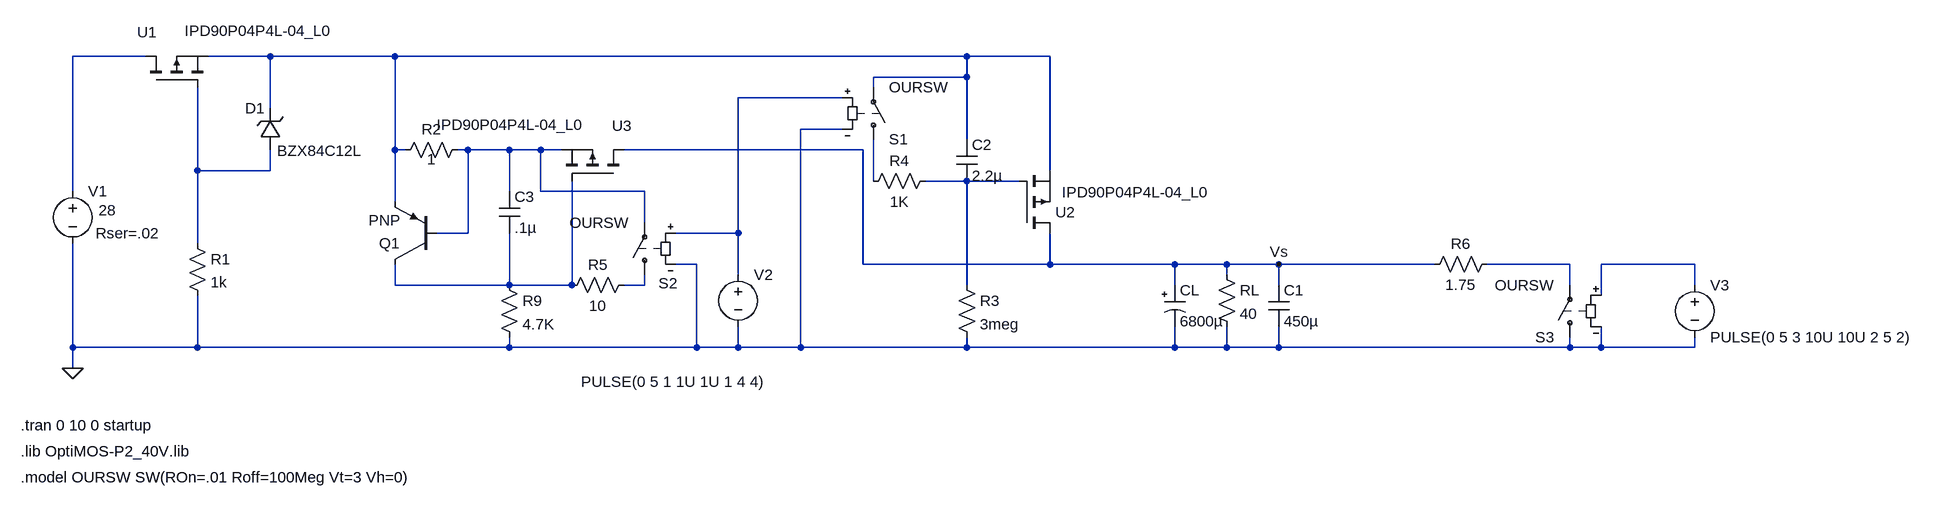
[diagram p0: schematic power_cond_2.asc]
power_cond_2.asc, the LTspice schematic file:
Version 4
SHEET 1 2268 1624
WIRE -1280 -176 -1392 -176
WIRE -1088 -176 -1184 -176
WIRE -896 -176 -1088 -176
WIRE -16 -176 -896 -176
WIRE 112 -176 -16 -176
WIRE -16 -144 -16 -176
WIRE -16 -144 -160 -144
WIRE -160 -128 -160 -144
WIRE -208 -112 -368 -112
WIRE -1088 -96 -1088 -176
WIRE -208 -64 -272 -64
WIRE -16 -48 -16 -144
WIRE -896 -32 -896 -176
WIRE -880 -32 -896 -32
WIRE -784 -32 -800 -32
WIRE -720 -32 -784 -32
WIRE -672 -32 -720 -32
WIRE -640 -32 -672 -32
WIRE -176 -32 -544 -32
WIRE -1200 0 -1200 -128
WIRE -1088 0 -1088 -32
WIRE -1088 0 -1200 0
WIRE 112 0 112 -176
WIRE -160 16 -160 -48
WIRE -16 16 -16 0
WIRE -16 16 -80 16
WIRE 64 16 -16 16
WIRE -1392 32 -1392 -176
WIRE -720 32 -720 -32
WIRE -672 32 -672 -32
WIRE -512 32 -672 32
WIRE -896 48 -896 -32
WIRE -512 80 -512 32
WIRE -784 96 -784 -32
WIRE -784 96 -832 96
WIRE -368 96 -368 -112
WIRE -368 96 -464 96
WIRE -1200 112 -1200 0
WIRE -432 144 -464 144
WIRE -176 144 -176 -32
WIRE 112 144 112 96
WIRE 112 144 -176 144
WIRE 304 144 112 144
WIRE 384 144 304 144
WIRE 464 144 384 144
WIRE 704 144 464 144
WIRE 912 144 784 144
WIRE 1104 144 960 144
WIRE -368 160 -368 96
WIRE 384 160 384 144
WIRE -896 176 -896 144
WIRE -720 176 -720 96
WIRE -720 176 -896 176
WIRE -624 176 -624 16
WIRE -624 176 -720 176
WIRE -512 176 -512 160
WIRE -512 176 -544 176
WIRE -16 176 -16 16
WIRE 304 176 304 144
WIRE 464 176 464 144
WIRE 912 176 912 144
WIRE 1104 176 1104 144
WIRE 960 192 960 144
WIRE -1392 272 -1392 112
WIRE -1200 272 -1200 192
WIRE -1200 272 -1392 272
WIRE -720 272 -720 256
WIRE -720 272 -1200 272
WIRE -432 272 -432 144
WIRE -432 272 -720 272
WIRE -368 272 -368 240
WIRE -368 272 -432 272
WIRE -272 272 -272 -64
WIRE -272 272 -368 272
WIRE -16 272 -16 256
WIRE -16 272 -272 272
WIRE 304 272 304 240
WIRE 304 272 -16 272
WIRE 384 272 384 240
WIRE 384 272 304 272
WIRE 464 272 464 240
WIRE 464 272 384 272
WIRE 912 272 912 256
WIRE 912 272 464 272
WIRE 960 272 960 240
WIRE 960 272 912 272
WIRE 1104 272 1104 256
WIRE 1104 272 960 272
WIRE -1392 304 -1392 272
FLAG -1392 304 0
FLAG 464 144 Vs
SYMBOL voltage -1392 16 R0
WINDOW 3 40 45 Left 2
WINDOW 123 0 0 Left 2
WINDOW 39 35 80 Left 2
SYMATTR Value 28
SYMATTR SpiceLine Rser=.02
SYMATTR InstName V1
SYMBOL res -1216 96 R0
SYMATTR InstName R1
SYMATTR Value 1k
SYMATTR SpiceLine tol=1 pwr=.125
SYMBOL polcap 288 176 R0
WINDOW 3 24 56 Left 2
SYMATTR Value 6800µ
SYMATTR InstName CL
SYMATTR SpiceLine V=35 Irms=3.67 Rser=0.03 Lser=0
SYMATTR Description Capacitor
SYMATTR Type cap
SYMBOL res 368 144 R0
SYMATTR InstName RL
SYMATTR Value 40
SYMBOL zener -1072 -32 R180
WINDOW 0 24 64 Left 2
WINDOW 3 -126 -1 Left 2
SYMATTR InstName D1
SYMATTR Value BZX84C12L
SYMBOL pmos -1280 -128 R270
WINDOW 0 85 -13 VRight 2
WINDOW 3 87 60 VRight 2
SYMATTR InstName U1
SYMATTR Value IPD90P04P4L-04_L0
SYMATTR Prefix X
SYMBOL cap 448 176 R0
SYMATTR InstName C1
SYMATTR Value 450µ
SYMBOL pmos 64 96 M180
WINDOW 3 66 63 Left 2
SYMATTR Value IPD90P04P4L-04_L0
SYMATTR InstName U2
SYMATTR Prefix X
SYMBOL res -784 -48 R90
WINDOW 0 0 56 VBottom 2
WINDOW 3 15 56 VTop 2
SYMATTR InstName R2
SYMATTR Value 1
SYMBOL pnp -832 144 R180
SYMATTR InstName Q1
SYMBOL cap -736 32 R0
SYMATTR InstName C3
SYMATTR Value .1µ
SYMBOL res -736 160 R0
SYMATTR InstName R9
SYMATTR Value 4.7K
SYMBOL pmos -544 16 M270
WINDOW 0 85 -13 VRight 2
WINDOW 3 87 60 VRight 2
SYMATTR InstName U3
SYMATTR Value IPD90P04P4L-04_L0
SYMATTR Prefix X
SYMBOL cap -32 -48 R0
SYMATTR InstName C2
SYMATTR Value 2.2µ
SYMBOL res -32 160 R0
SYMATTR InstName R3
SYMATTR Value 3meg
SYMBOL sw -160 -32 M180
SYMATTR InstName S1
SYMATTR Value OURSW
SYMBOL voltage -368 144 R0
WINDOW 3 -242 181 Left 2
WINDOW 123 0 0 Left 2
WINDOW 39 0 0 Left 2
SYMATTR InstName V2
SYMATTR Value PULSE(0 5 1 1U 1U 1 4 4)
SYMBOL sw -512 176 R180
WINDOW 0 -51 3 Left 2
SYMATTR InstName S2
SYMATTR Value OURSW
SYMBOL res -64 0 R90
WINDOW 0 0 56 VBottom 2
WINDOW 3 32 56 VTop 2
SYMATTR InstName R4
SYMATTR Value 1K
SYMBOL res -528 160 R90
WINDOW 0 0 56 VBottom 2
WINDOW 3 32 56 VTop 2
SYMATTR InstName R5
SYMATTR Value 10
SYMBOL voltage 1104 160 R0
WINDOW 123 0 0 Left 2
WINDOW 39 0 0 Left 2
SYMATTR InstName V3
SYMATTR Value PULSE(0 5 3 10U 10U 2 5 2)
SYMBOL sw 912 272 R180
SYMATTR InstName S3
SYMATTR Value OURSW
SYMBOL res 800 128 R90
WINDOW 0 0 56 VBottom 2
WINDOW 3 32 56 VTop 2
SYMATTR InstName R6
SYMATTR Value 1.75
TEXT -1472 392 Left 2 !.tran 0 10 0 startup
TEXT -1472 432 Left 2 !.lib OptiMOS-P2_40V.lib
TEXT -1472 472 Left 2 !.model OURSW SW(ROn=.01 Roff=100Meg Vt=3 Vh=0)

The netlist it stands for:
* power_cond_2.asc
V1 N001 0 28 Rser=.02
R1 N005 0 1k tol=1 pwr=.125
CL Vs 0 6800µ V=35 Irms=3.67 Rser=0.03 Lser=0
RL Vs 0 40
D1 N005 N002 BZX84C12L
XU1 N001 N005 N002 IPD90P04P4L-04_L0  ; pins D G S
C1 Vs 0 450µ
XU2 Vs N007 N002 IPD90P04P4L-04_L0  ; pins D G S
R2 N004 N002 1
Q1 N010 N004 N002 0 PNP
C3 N004 N010 .1µ
R9 N010 0 4.7K
XU3 Vs N010 N004 IPD90P04P4L-04_L0  ; pins D G S
C2 N002 N007 2.2µ
R3 N007 0 3meg
S1 N006 N002 N003 0 OURSW
V2 N003 0 PULSE(0 5 1 1U 1U 1 4 4)
S2 N011 N004 N003 0 OURSW
R4 N007 N006 1K
R5 N011 N010 10
V3 N009 0 PULSE(0 5 3 10U 10U 2 5 2)
S3 0 N008 N009 0 OURSW
R6 N008 Vs 1.75
.model D D
.lib standard.dio
.model NPN NPN
.model PNP PNP
.lib standard.bjt
.tran 0 10 0 startup
.lib OptiMOS-P2_40V.lib
.model OURSW SW(ROn=.01 Roff=100Meg Vt=3 Vh=0)
.backanno
.end